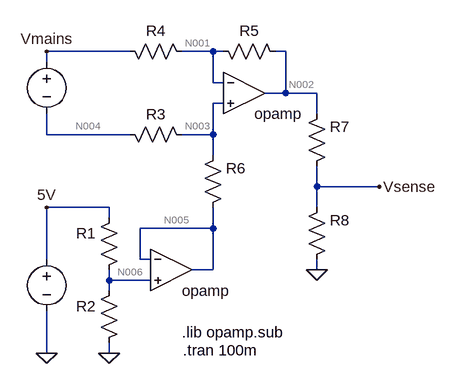
[diagram p0: schematic schematic.asc]
schematic.asc, the LTspice schematic file:
Version 4
SHEET 1 880 680
WIRE 16 -144 -112 -144
WIRE 144 -144 96 -144
WIRE 160 -144 144 -144
WIRE 256 -144 240 -144
WIRE -112 -128 -112 -144
WIRE 144 -96 144 -144
WIRE 160 -96 144 -96
WIRE 256 -80 256 -144
WIRE 256 -80 224 -80
WIRE 304 -80 256 -80
WIRE 160 -64 144 -64
WIRE 304 -48 304 -80
WIRE -112 -16 -112 -48
WIRE 16 -16 -112 -16
WIRE 144 -16 144 -64
WIRE 144 -16 96 -16
WIRE 144 16 144 -16
WIRE 304 64 304 32
WIRE 400 64 304 64
WIRE -16 96 -112 96
WIRE 304 96 304 64
WIRE -16 112 -16 96
WIRE 144 128 144 96
WIRE 144 128 32 128
WIRE -112 176 -112 96
WIRE 32 176 32 128
WIRE 48 176 32 176
WIRE 144 192 144 128
WIRE 144 192 112 192
WIRE 304 192 304 176
WIRE -16 208 -16 192
WIRE 48 208 -16 208
WIRE -16 224 -16 208
WIRE -112 320 -112 256
WIRE -16 320 -16 304
FLAG -16 320 0
FLAG -112 320 0
FLAG 304 192 0
FLAG -112 -144 Vmains
FLAG -112 96 5V
FLAG 400 64 Vsense
SYMBOL Opamps\\opamp 80 128 R0
WINDOW 0 1 33 Invisible 2
SYMATTR InstName U1
SYMBOL Opamps\\opamp 192 -144 R0
WINDOW 0 0 32 Invisible 2
SYMATTR InstName U2
SYMBOL res 0 96 M0
WINDOW 3 36 76 Invisible 2
SYMATTR InstName R1
SYMATTR Value 1k
SYMBOL res 0 208 M0
WINDOW 3 36 76 Invisible 2
SYMATTR InstName R2
SYMATTR Value 1k
SYMBOL res 112 0 M270
WINDOW 0 32 56 VTop 2
WINDOW 3 0 56 Invisible 2
SYMATTR InstName R3
SYMATTR Value 100k
SYMBOL res 112 -128 M270
WINDOW 0 32 56 VTop 2
WINDOW 3 0 56 Invisible 2
SYMATTR InstName R4
SYMATTR Value 100k
SYMBOL res 256 -128 M270
WINDOW 0 32 56 VTop 2
WINDOW 3 0 56 Invisible 2
SYMATTR InstName R5
SYMATTR Value 1k
SYMBOL res 128 112 M180
WINDOW 0 36 76 Left 2
WINDOW 3 36 40 Invisible 2
SYMATTR InstName R6
SYMATTR Value 1k
SYMBOL voltage -112 -144 M0
WINDOW 0 24 16 Invisible 2
WINDOW 3 24 96 Invisible 2
SYMATTR InstName V1
SYMATTR Value SINE(0 180 60)
SYMBOL voltage -112 160 R0
WINDOW 0 24 16 Invisible 2
WINDOW 3 24 96 Invisible 2
SYMATTR InstName V2
SYMATTR Value 5
SYMBOL res 288 48 M180
WINDOW 0 36 76 Left 2
WINDOW 3 36 40 Invisible 2
SYMATTR InstName R7
SYMATTR Value 1k
SYMBOL res 288 192 M180
WINDOW 0 36 76 Left 2
WINDOW 3 36 40 Invisible 2
SYMATTR InstName R8
SYMATTR Value 2k
TEXT 96 288 Left 2 !.lib opamp.sub
TEXT 98 316 Left 2 !.tran 100m

The netlist it stands for:
* schematic.asc
XU1 N005 N006 N005 opamp Aol=100K GBW=10Meg  ; pins invin noninvin out
XU2 N001 N003 N002 opamp Aol=100K GBW=10Meg  ; pins invin noninvin out
R1 5V N006 1k
R2 N006 0 1k
R3 N003 N004 100k
R4 N001 Vmains 100k
R5 N002 N001 1k
R6 N005 N003 1k
V1 Vmains N004 SINE(0 180 60)
V2 5V 0 5
R7 Vsense N002 1k
R8 0 Vsense 2k
.lib opamp.sub
.tran 100m
.backanno
.end

* Results of the author's LTspice run, read from the files saved beside the schematic
* Operating Point, zero values left out:
*   V(n005) = 2.5 V
*   V(n006) = 2.5 V
*   V(n002) = 2.5 V
*   V(n003) = 2.5 V
*   V(n001) = 2.5 V
*   V(5v) = 5 V
*   V(n004) = 2.5 V
*   V(vmains) = 2.5 V
*   V(vsense) = 1.667 V
*   I(R8) = -833.3 µA
*   I(R7) = -833.3 µA
*   I(R6) = 125 pA
*   I(R5) = -125 pA
*   I(R4) = -125 pA
*   I(R3) = 125 pA
*   I(R2) = 2.5 mA
*   I(R1) = 2.5 mA
*   I(V2) = -2.5 mA
*   I(V1) = -125 pA
*   Ix(u1:3) = -125 pA
*   Ix(u2:3) = -833.3 µA
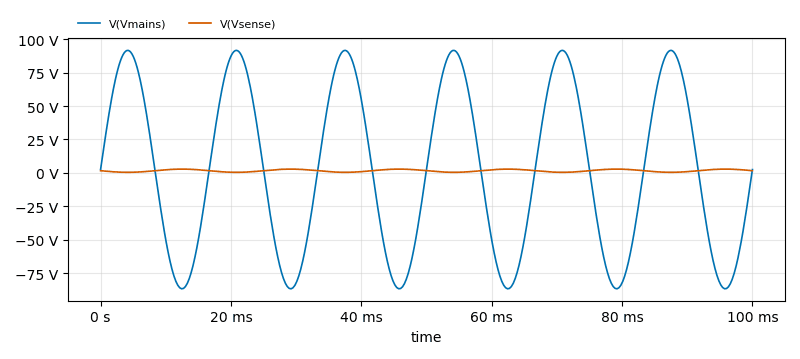
[diagram p1: Transient Analysis of schematic.asc, plotted from the saved traces]
* Transient Analysis, 1 run:
*   V(Vmains): min -86.58 V, max 91.6 V, average 2.517 V, rms 63.06 V, last 2.5 V
*   V(Vsense): min 467.1 mV, max 2.866 V, average 1.666 V, rms 1.87 V, last 1.667 V